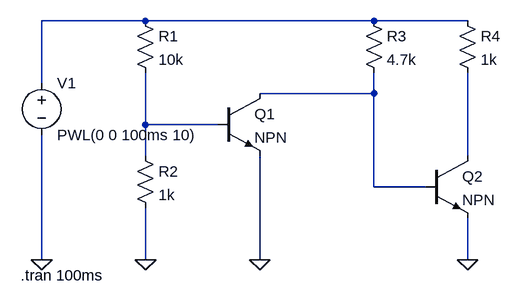
[diagram p0: schematic Overvoltage-Protection-NPN.asc]
Overvoltage-Protection-NPN.asc, the LTspice schematic file:
Version 4
SHEET 1 880 680
WIRE -16 -16 -176 -16
WIRE 336 -16 -16 -16
WIRE 480 -16 336 -16
WIRE -176 80 -176 -16
WIRE 336 96 336 64
WIRE 336 96 160 96
WIRE -16 144 -16 64
WIRE 96 144 -16 144
WIRE -16 192 -16 144
WIRE 480 192 480 64
WIRE 336 240 336 96
WIRE 416 240 336 240
WIRE -176 352 -176 160
WIRE -16 352 -16 272
WIRE 160 352 160 192
WIRE 480 352 480 288
FLAG -176 352 0
FLAG -16 352 0
FLAG 160 352 0
FLAG 480 352 0
SYMBOL npn 96 96 R0
SYMATTR InstName Q1
SYMBOL npn 416 192 R0
SYMATTR InstName Q2
SYMBOL voltage -176 64 R0
WINDOW 123 0 0 Left 0
WINDOW 39 0 0 Left 0
SYMATTR InstName V1
SYMATTR Value PWL(0 0 100ms 10)
SYMBOL res -32 -32 R0
SYMATTR InstName R1
SYMATTR Value 10k
SYMBOL res -32 176 R0
SYMATTR InstName R2
SYMATTR Value 1k
SYMBOL res 320 -32 R0
SYMATTR InstName R3
SYMATTR Value 4.7k
SYMBOL res 464 -32 R0
SYMATTR InstName R4
SYMATTR Value 1k
TEXT -208 376 Left 2 !.tran 100ms

The netlist it stands for:
* Overvoltage-Protection-NPN.asc
Q1 N002 N003 0 0 NPN
Q2 N004 N002 0 0 NPN
V1 N001 0 PWL(0 0 100ms 10)
R1 N001 N003 10k
R2 N003 0 1k
R3 N001 N002 4.7k
R4 N001 N004 1k
.model NPN NPN
.model PNP PNP
.lib standard.bjt
.tran 100ms
.backanno
.end